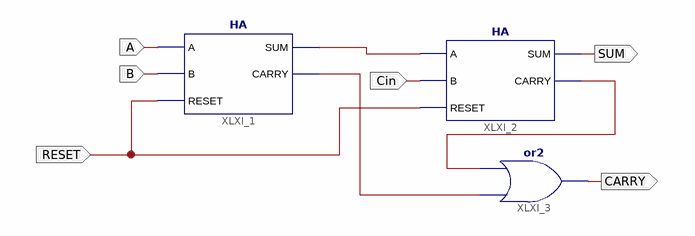
[diagram p0: schematic sheet 1]
// Xilinx ISE schematic FA.sch (artix7) as structural Verilog: 3 symbols, 6 ports
module FA (
  input  RESET,
  input  Cin,
  input  A,
  input  B,
  output SUM,
  output CARRY
);

  wire XLXN_8, XLXN_10, XLXN_11;

  HA XLXI_1 (.A(A), .B(B), .CARRY(XLXN_11), .RESET(RESET), .SUM(XLXN_8));
  HA XLXI_2 (.A(XLXN_8), .B(Cin), .CARRY(XLXN_10), .RESET(RESET), .SUM(SUM));
  or XLXI_3 (CARRY, XLXN_11, XLXN_10);
endmodule
